# EAGLE design blackmagic_richardeoin (EAGLE 7.4.0)
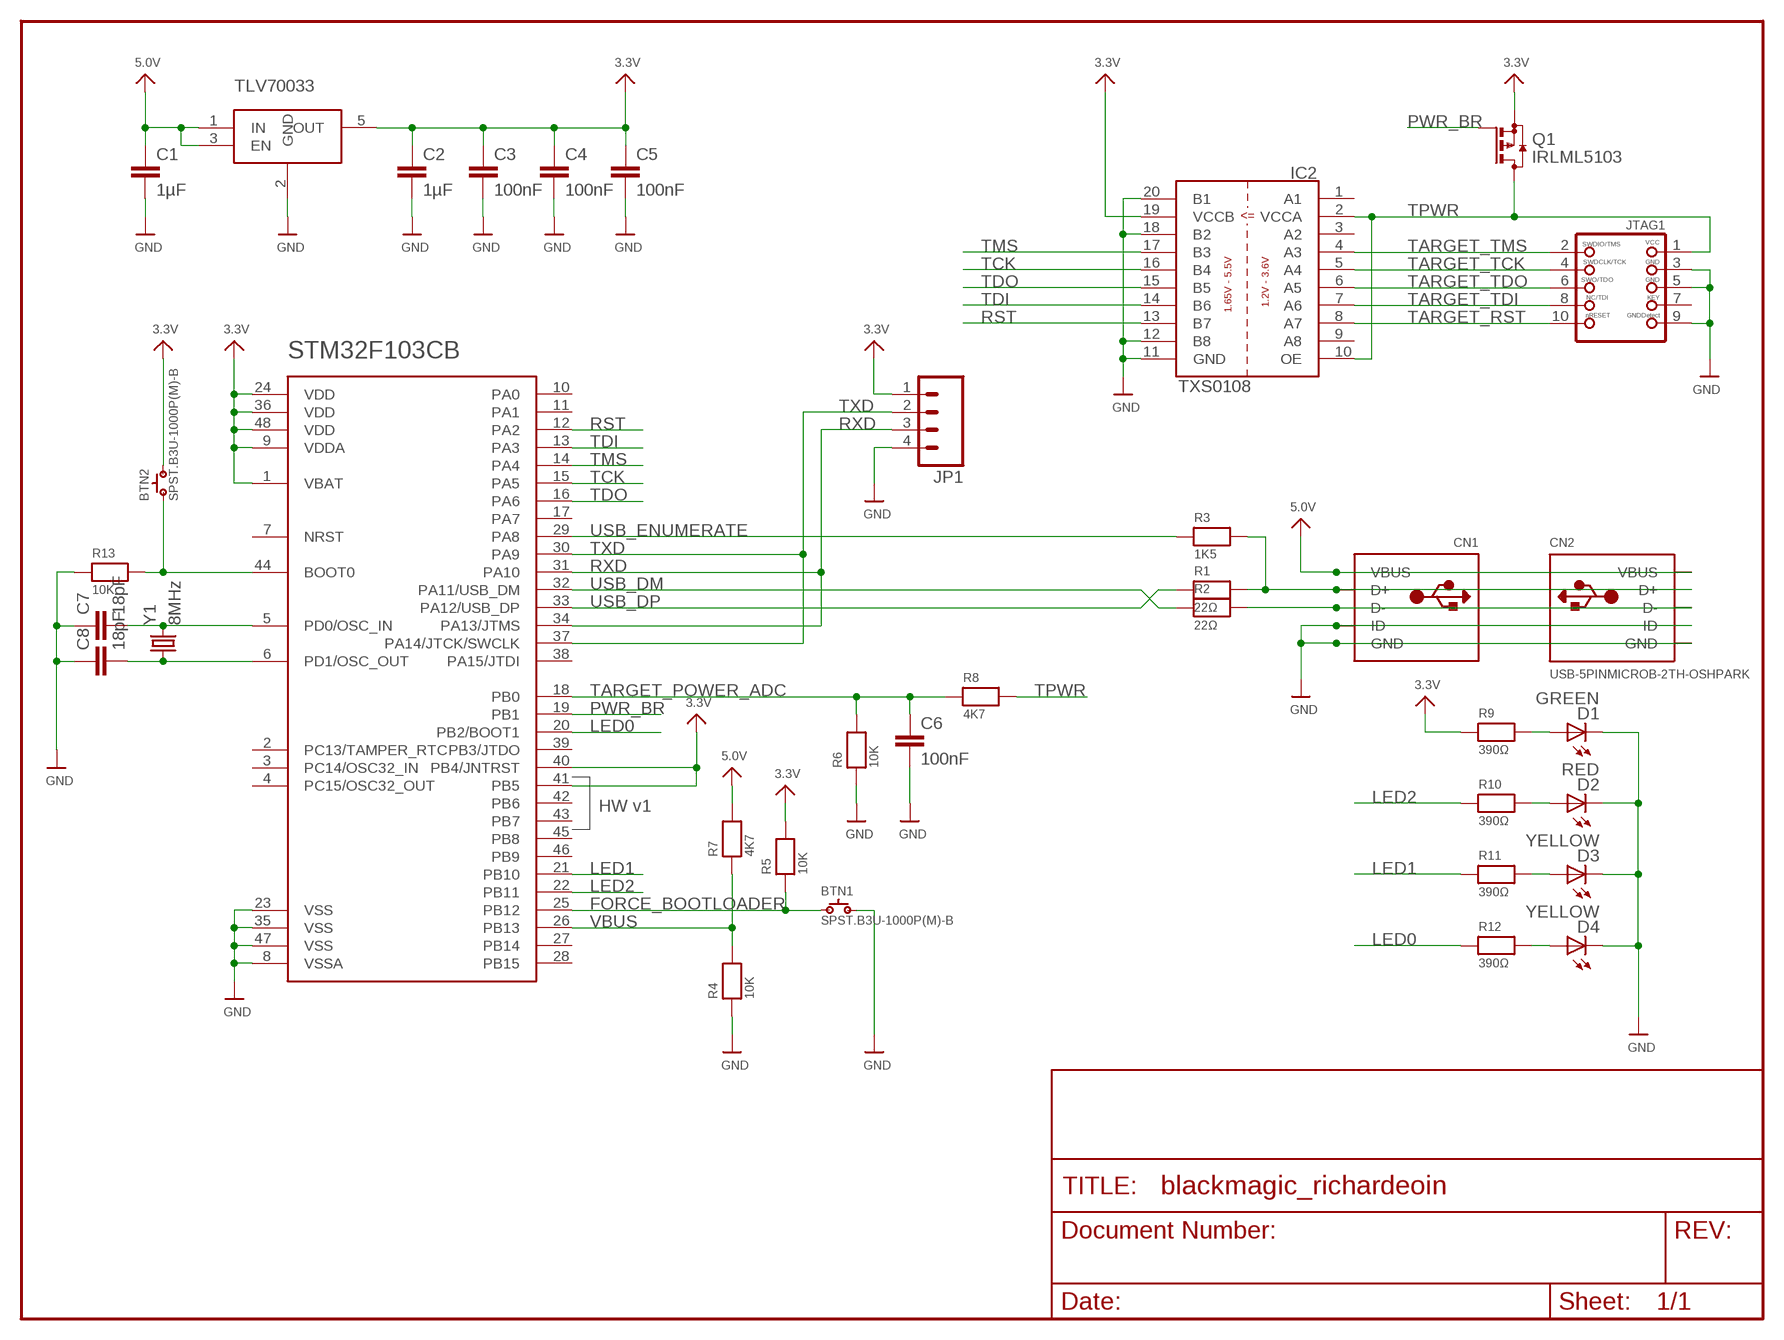
[diagram p0: schematic, sheet 1]

## Parts
BTN1  SPST.B3U-1000P(M)-B  [B3U-1000P(M)-B]
BTN2  SPST.B3U-1000P(M)-B  [B3U-1000P(M)-B]
C1  1µF  C-EUC0603K  [C0603K]
C2  1µF  C-EUC0603K  [C0603K]
C3  100nF  C-EUC0603K  [C0603K]
C4  100nF  C-EUC0603K  [C0603K]
C5  100nF  C-EUC0603K  [C0603K]
C6  100nF  C-EUC0603K  [C0603K]
C7  18pF  C-EUC0603K  [C0603K]
C8  18pF  C-EUC0603K  [C0603K]
CN1  USBMINIB  [USB-MINIB]
CN2  USB-5PINMICROB-2TH-OSHPARK  [USB-MICROB-2TH-OSHPARK]
D1  GREEN  LEDCHIPLED_0603  [CHIPLED_0603]
D2  RED  LEDCHIPLED_0603  [CHIPLED_0603]
D3  YELLOW  LEDCHIPLED_0603  [CHIPLED_0603]
D4  YELLOW  LEDCHIPLED_0603  [CHIPLED_0603]
IC1  STM32F_48PIN  [TQFP48]
IC2  TXS0108  TX0108PWR  [TSSOP20]
IC3  TLV70033DCK  TLV700DCK  [SC70-5L]
JP1  M04LOCK  [1X04_LOCK]
JTAG1  JTAG-CORTEXM3TH  [2X05_1.27MM_TH]
Q1  IRLML5103  BSS84  [SOT23]
R1  22Ω  RESISTOR0603MINI  [0603-MINI]
R2  22Ω  RESISTOR0603MINI  [0603-MINI]
R3  1K5  RESISTOR0603MINI  [0603-MINI]
R4  10K  RESISTOR0603MINI  [0603-MINI]
R5  10K  RESISTOR0603MINI  [0603-MINI]
R6  10K  RESISTOR0603MINI  [0603-MINI]
R7  4K7  RESISTOR0603MINI  [0603-MINI]
R8  4K7  RESISTOR0603MINI  [0603-MINI]
R9  390Ω  RESISTOR0603MINI  [0603-MINI]
R10  390Ω  RESISTOR0603MINI  [0603-MINI]
R11  390Ω  RESISTOR0603MINI  [0603-MINI]
R12  390Ω  RESISTOR0603MINI  [0603-MINI]
R13  10K  RESISTOR0603MINI  [0603-MINI]
Y1  8MHz  CRYSTAL5X3  [CRYSTAL-SMD-5X3]

## Nets
3.3V: BTN2.2 C2.1 C3.1 C4.1 C5.1 IC1.1(VBAT) IC1.9(VDDA) IC1.24(VDD) IC1.36(VDD) IC1.40(PB4/JNTRST) IC1.41(PB5) IC1.48(VDD) IC2.19(VCCB) IC3.5(OUT) JP1.1 Q1.2(S) R5.2 R9.1
5.0V: C1.1 CN1.VBUS CN2.VBUS IC3.1(IN) IC3.3(EN) R7.2
BOOT0: BTN2.1 IC1.44(BOOT0) R13.2
D+: CN1.D+ CN2.D+ R1.2 R3.2
D-: CN1.D- CN2.D- R2.2
FORCE_BOOTLOADER: BTN1.1 IC1.25(PB12) R5.1
GND: BTN1.2 C1.2 C2.2 C3.2 C4.2 C5.2 C6.2 C7.1 C8.1 CN1.GND CN1.ID CN2.GND CN2.ID D1.C D2.C D3.C D4.C IC1.8(VSSA) IC1.23(VSS) IC1.35(VSS) IC1.47(VSS) IC2.11(GND) IC2.12(B8) IC2.18(B2) IC2.20(B1) IC3.2(GND) JP1.4 JTAG1.3 JTAG1.5 JTAG1.9 R4.1 R6.1 R13.1
LED0: IC1.20(PB2/BOOT1) R12.1
LED1: IC1.21(PB10) R11.1
LED2: IC1.22(PB11) R10.1
LPC_XTAL2: C8.2 IC1.6(PD1/OSC_OUT) Y1.1
N$2: D2.A R10.2
N$4: D1.A R9.2
N$6: D3.A R11.2
N$8: D4.A R12.2
OSC_IN: C7.2 IC1.5(PD0/OSC_IN) Y1.3
PWR_BR: IC1.19(PB1) Q1.1(G)
RST: IC1.12(PA2) IC2.13(B7)
RXD: IC1.31(PA10) IC1.34(PA13/JTMS) JP1.3
TARGET_POWER_ADC: C6.1 IC1.18(PB0) R6.2 R8.1
TARGET_RST: IC2.8(A7) JTAG1.10
TARGET_TCK: IC2.5(A4) JTAG1.4
TARGET_TDI: IC2.7(A6) JTAG1.8
TARGET_TDO: IC2.6(A5) JTAG1.6
TARGET_TMS: IC2.4(A3) JTAG1.2
TCK: IC1.15(PA5) IC2.16(B4)
TDI: IC1.13(PA3) IC2.14(B6)
TDO: IC1.16(PA6) IC2.15(B5)
TMS: IC1.14(PA4) IC2.17(B3)
TPWR: IC2.2(VCCA) IC2.10(OE) JTAG1.1 Q1.3(D) R8.2
TXD: IC1.30(PA9) IC1.37(PA14/JTCK/SWCLK) JP1.2
USB_DM: IC1.32(PA11/USB_DM) R2.1
USB_DP: IC1.33(PA12/USB_DP) R1.1
USB_ENUMERATE: IC1.29(PA8) R3.1
VBUS: IC1.26(PB13) R4.2 R7.1
Unconnected: IC1.2(PC13/TAMPER_RTC) IC1.3(PC14/OSC32_IN) IC1.4(PC15/OSC32_OUT) IC1.7(NRST) IC1.10(PA0) IC1.11(PA1) IC1.17(PA7) IC1.27(PB14) IC1.28(PB15) IC1.38(PA15/JTDI) IC1.39(PB3/JTDO) IC1.42(PB6) IC1.43(PB7) IC1.45(PB8) IC1.46(PB9) IC2.1(A1) IC2.3(A2) IC2.9(A8) JTAG1.7

## Notes on the sheet
- TLV70033
- STM32F103CB
- HW v1

## Library data of the parts
BTN1 BTN2 = omron:SPST
C1-C8 = resistor:C-EU: CAPACITOR, European symbol
CN1 = blackmagic_richardeoin:USB: USB Connectors USBMINIB - Surface Mount Female Mini-B USB Connector 4UConnector: 06564
CN2 = flabbergast:USB-5PIN
D1-D4 = led:LED: LED OSRAM: - CHIPLED LG R971, LG N971, LY N971, LG Q971, LY Q971, LO R971, LY R971 LH N974, LH R974 LS Q976, LO Q976, LY Q976 LO Q996 - Hyper CHIPLED LW Q18S LB Q993, LB Q99A, LB R99A - SideLED LS A670, LO A670, LY A670, LG A670, LP A670 LB A673, LV A673, LT A673, LW A673 LH A674 LY A675 LS A676, LA A676, LO A676, LY A676, LW A676 LS A679, LY A679, LG A679 - Hyper Micro SIDELED® LS Y876, LA Y876, LO Y876, LY Y876 LT Y87S - SmartLED LW L88C, LW L88S LB L89C, LB L89S, LG L890 LS L89K, LO L89K, LY L89K LS L896, LA L896, LO L896, LY L896 - TOPLED LS T670, LO T670, LY T670, LG T670, LP T670 LSG T670, LSP T670, LSY T670, LOP T670, LYG T670 LG T671, LOG T671, LSG T671 LB T673, LV T673, LT T673, LW T673 LH T674 LS T676, LA T676, LO T676, LY T676, LB T676, LH T676, LSB T676, LW T676 LB T67C, LV T67C, LT T67C, LS T67K, LO T67K, LY T67K, LW E67C LS E67B, LA E67B, LO E67B, LY E67B, LB E67C, LV E67C, LT E67C LW T67C LS T679, LY T679, LG T679 LS T770, LO T770, LY T770, LG T770, LP T770 LB T773, LV T773, LT T773, LW T773 LH T774 LS E675, LA E675, LY E675, LS T675 LS T776, LA T776, LO T776, LY T776, LB T776 LHGB T686 LT T68C, LB T68C - Hyper Mini TOPLED® LB M676 - Mini TOPLED Santana® LG M470 LS M47K, LO M47K, LY M47K Source: http://www.osram.convergy.de LUXEON: - LUMILED® LXK2-PW12-R00, LXK2-PW12-S00, LXK2-PW14-U00, LXK2-PW14-V00 LXK2-PM12-R00, LXK2-PM12-S00, LXK2-PM14-U00 LXK2-PE12-Q00, LXK2-PE12-R00, LXK2-PE12-S00, LXK2-PE14-T00, LXK2-PE14-U00 LXK2-PB12-K00, LXK2-PB12-L00, LXK2-PB12-M00, LXK2-PB14-N00, LXK2-PB14-P00, LXK2-PB14-Q00 LXK2-PR12-L00, LXK2-PR12-M00, LXK2-PR14-Q00, LXK2-PR14-R00 LXK2-PD12-Q00, LXK2-PD12-R00, LXK2-PD12-S00 LXK2-PH12-R00, LXK2-PH12-S00 LXK2-PL12-P00, LXK2-PL12-Q00, LXK2-PL12-R00 Source: www.luxeon.com KINGBRIGHT: KA-3528ASYC Source: www.kingbright.com
IC1 = stm32f:STM32F_48PIN
IC2 = dan-translate:TX0108: TXB0108 or TXS0108
IC3 = tlv700:TLV700
JP1 = SparkFun:M04: Header 4 Standard 4-pin 0.1" header. Use with straight break away headers (SKU : PRT-00116), right angle break away headers (PRT-00553), swiss pins (PRT-00743), machine pins (PRT-00117), and female headers (PRT-00115). Molex polarized connector foot print use with SKU : PRT-08231 with associated crimp pins and housings. 1MM SMD Version SKU: PRT-10208
JTAG1 = blackmagic_richardeoin:JTAG-CORTEXM3: Serial Wire (SW-DP) Connector This standard 0.05" 10-pin connector is for use with the Cortex M0/M3's native SWD (serial wire debugger) interface (SW-DP). Some boards support a 20-pin combined JTAG+SWD connector (SWJ-DP), such as the LPC1700 family, but many smaller devices only work with SWD which typically use the smaller 10-pin SW-DP connecter (the LPC1300 family, for example, only supports SWD). 2x05 1.27mm/0.05" Connector: This is the standard SMT connector defined by ARM for all Cortex devices, and should be used in most situations and for forward-compatibility since any new devices coming to market will likely use this connector. MOLEX 10 Pin 0.1" Connector: This 0.1" 10 pin connector has the same pin layout as the standard 0.05" connector, but is easier to work with if you are using standard jumper wires or custom cables to connect your SWD hardware. MOLEX 20 Pin 0.1" Connector: This 0.1" 20 pin connector is the same model used for ARM7/ARM9 JTAG debuggers, but is connected to match the pins on the Segger J-Link for ARM (which supports both JTAG and SWD debugging). See the following document from ARM for more information on Cortex M3 Debug Connectors: http://infocenter.arm.com/help/topic/com.arm.doc.faqs/attached/13634/cortex_debug_connectors.pdf And the following page for an overview with images of the different connector types: http://www.keil.com/peripherals/coresight/connectors.asp
Q1 = transistor-small-signal:BSS84: P-CHANNEL MOS FET
R1-R13 = microbuilder:RESISTOR: Resistors 0402 - 0402 Surface Mount Package 22 Ohm 1% 1/16W [Digikey: 311-22.0LRTR-ND] 33 Ohm 5% 1/16W 1.0K 5% 1/16W 1.5K 5% 1/16W 2.0K 1% 1/16W 10.0K 1% 1/16W [Digikey: 311-10.0KLRTR-ND] 10.0K 5% 1/16W [Digikey: RMCF0402JT10K0TR-ND] 12.1K 1% 1/16W [Digikey: 311-22.0LRTR-ND] 100.0K 5% 1/16W 0603 - 0603 Surface Mount Package 0 Ohm 1/10 Watt 1% Resistor 15 Ohm 1/10 Watt 1% Resistor 33 Ohm 1/10 Watt 1% Resistor 49.9 Ohm 1/10 Watt 1% Resistor 100 Ohm 1/10 Watt 1% Resistor 150 Ohm 1/10 Watt 1% Resistor 240 Ohm 1/10 Watt 1% Resistor 390 Ohm 1/10 Watt 1% Resistor 560 Ohm 1/10 Watt 1% Resistor 680 Ohm 1/10 Watt 1% Resistor 750 Ohm 1/10 Watt 1% Resistor 1.0K Ohm 1/10 Watt 1% Resistor 1.5K Ohm 1/10 Watt 1% Resistor 2.0K Ohm 1/10 Watt 1% Resistor 2.2K Ohm 1/10 Watt 1% Resistor 3.3K Ohm 1/10 Watt 1% Resistor 4.7K Ohm 1/10 Watt 1% Resistor 10.0K Ohm 1/10 Watt 1% Resistor 12.0K Ohm 1/10 Watt 1% Resistor 12.1K Ohm 1/10 Watt 1% Resistor 20.0K Ohm 1/10 Watt 1% Resistor 33.0K Ohm 1/10 Watt 1% Resistor 100.0K Ohm 1/10 Watt 1% Resistor 0805 - 0805 Surface Mount Package 0 Ohm 1/8 Watt 1% Resistor 33 Ohm 1/8 Watt 1% Resistor 100 Ohm 1/8 Watt 1% Resistor 150 Ohm 1/8 Watt 1% Resistor 200 Ohm 1/8 Watt 1% Resistor 240 Ohm 1/8 Watt 1% Resistor 330 Ohm 1/8 Watt 1% Resistor 390 Ohm 1/8 Watt 1% Resistor 470 Ohm 1/8 Watt 1% Resistor 1.0K Ohm 1/8 Watt 1% Resistor 1.5K Ohm 1/8 Watt 1% Resistor 2.0K Ohm 1/8 Watt 1% Resistor 4.7K Ohm 1/8 Watt 1% Resistor 5.1K Ohm 1/8 Watt 1% Resistor 5.6K Ohm 1/8 Watt 1% Resistor 10.0K Ohm 1/8 Watt 1% Resistor 22.0K Ohm 1/8 Watt 1% Resistor 33.0K Ohm 1/8 Watt 1% Resistor 100K Ohm 1/8 Watt 1% Resistor 1206 - 1206 Surface Mount Package 2012 - 2010 Surface Mount Package 0.11 Ohm 1/2 Watt 1% Resistor - Digikey: RHM.11UCT-ND
Y1 = SparkFun:CRYSTAL: Crystals Various standard crystals. Proven footprints. Spark Fun Electronics SKU : COM-00534

## Board
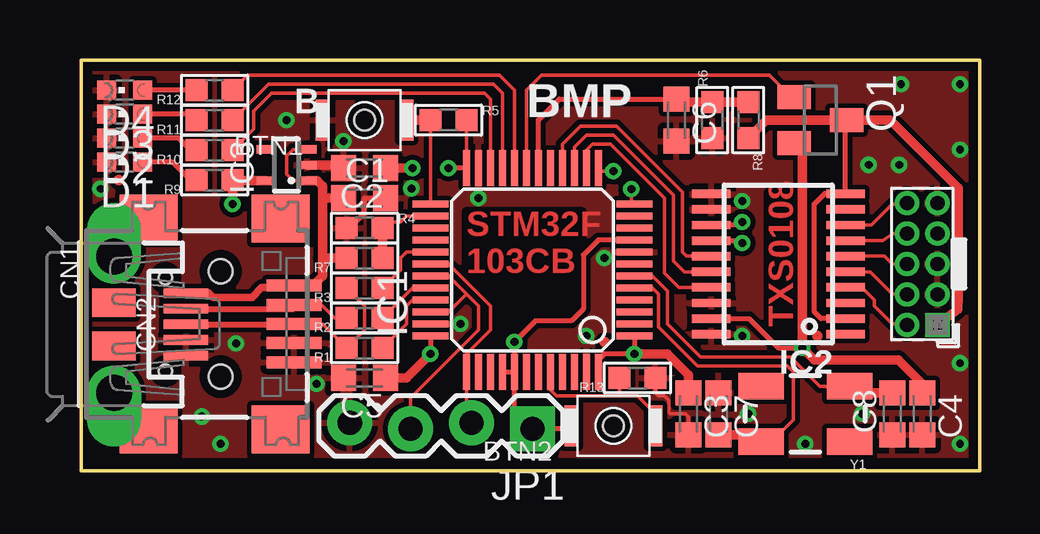
[diagram p1: board, top side]
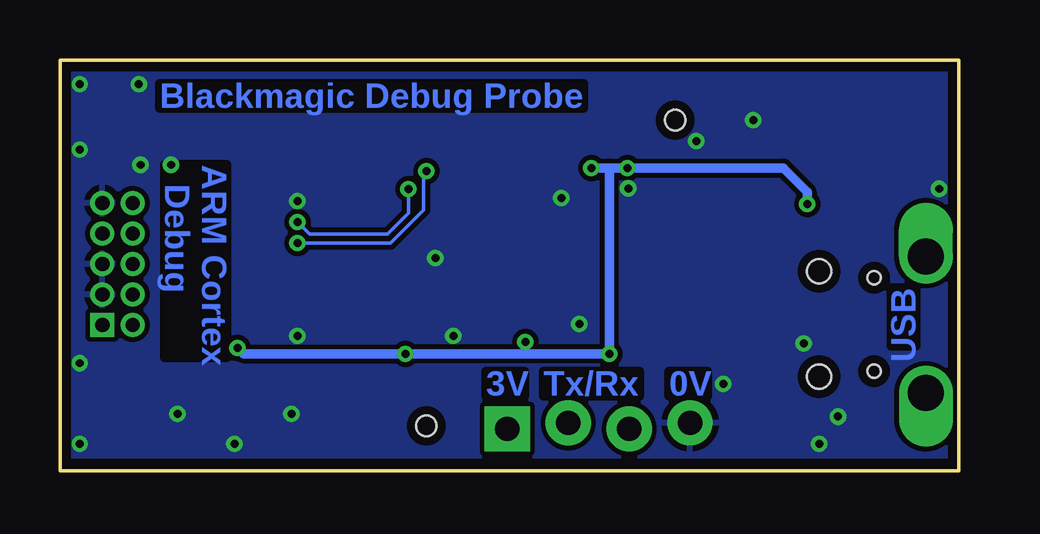
[diagram p2: board, bottom side, seen from below]

Size 37.47 x 17.15 mm. Coordinates in mm from the lower left corner, seen from the top.
Outline: 0,0 37.47,0 37.47,17.15 0,17.15 0,0
Copper layers (1*16): Top 0.0356mm / dielectric 1.5011mm / Bottom 0.0356mm
Design rules "LaenPCBOrder *": minimum track width 6mil, minimum drill 13mil, track to track 6mil, track to pad 6mil, pad to pad 6mil, via to via 6mil, smd to smd 0mil, copper to edge 15mil, drill to drill 6mil, minimum pad ring 7mil, minimum via ring 7mil, stop-mask expansion 3mil, vias tented up to drill 14mil, thermal gap 10mil

### Footprints (pad centres in the part's own frame; a part is rotated, then mirrored left to right if it is on the bottom)
B3U-1000P(M)-B = smd 0.6 x 1.7: 1 -1.75,0; 2 1.75,0 | hole 0.85: 0,0
C0603K = smd 1.05 x 1.08: 1 -0.875,0; 2 0.875,0
USB-MINIB = smd 0.5 x 2.308: D+ 0,4.064; D- -0.8,4.064; GND 1.6,4.064; ID 0.8,4.064; VBUS -1.6,4.064 | smd 2 x 2.4: GND1 -4.4,-2; GND2 -4.4,3.5; GND3 4.4,3.5; GND4 4.4,-2 | hole 1: -2.2,1; 2.2,1
USB-MICROB-2TH-OSHPARK = smd 0.4 x 1.84: D+ 0,3 | smd 0.4 x 1.85: D- -0.65,3; GND 1.3,3; ID 0.65,3; VBUS -1.3,3 | smd 1.2 x 1.8: MT1 -0.9,0; MT2 0.9,0 | drill 1.5 pad 2.15 offset: MT3 -2.825,0; MT4 2.85,0 | hole 0.55: -1.95,2.15; 1.95,2.15
CHIPLED_0603 = smd 0.8 x 0.8: A 0,-0.75; C 0,0.75
TQFP48 = smd 0.3 x 1.5: 1 -2.75,-4.25; 2 -2.25,-4.25; 3 -1.75,-4.25; 4 -1.25,-4.25; 5 -0.75,-4.25; 6 -0.25,-4.25; 7 0.25,-4.25; 8 0.75,-4.25; 9 1.25,-4.25; 10 1.75,-4.25; 11 2.25,-4.25; 12 2.75,-4.25; 25 2.75,4.25; 26 2.25,4.25; 27 1.75,4.25; 28 1.25,4.25; 29 0.75,4.25; 30 0.25,4.25; 31 -0.25,4.25; 32 -0.75,4.25; 33 -1.25,4.25; 34 -1.75,4.25; 35 -2.25,4.25; 36 -2.75,4.25 | smd 1.5 x 0.3: 13 4.25,-2.75; 14 4.25,-2.25; 15 4.25,-1.75; 16 4.25,-1.25; 17 4.25,-0.75; 18 4.25,-0.25; 19 4.25,0.25; 20 4.25,0.75; 21 4.25,1.25; 22 4.25,1.75; 23 4.25,2.25; 24 4.25,2.75; 37 -4.25,2.75; 38 -4.25,2.25; 39 -4.25,1.75; 40 -4.25,1.25; 41 -4.25,0.75; 42 -4.25,0.25; 43 -4.25,-0.25; 44 -4.25,-0.75; 45 -4.25,-1.25; 46 -4.25,-1.75; 47 -4.25,-2.25; 48 -4.25,-2.75
TSSOP20 = smd 0.35 x 1.6: 1 -2.925,-2.8; 2 -2.275,-2.8; 3 -1.625,-2.8; 4 -0.975,-2.8; 5 -0.325,-2.8; 6 0.325,-2.8; 7 0.975,-2.8; 8 1.625,-2.8; 9 2.275,-2.8; 10 2.925,-2.8; 11 2.925,2.8; 12 2.275,2.8; 13 1.625,2.8; 14 0.975,2.8; 15 0.325,2.8; 16 -0.325,2.8; 17 -0.975,2.8; 18 -1.625,2.8; 19 -2.275,2.8; 20 -2.925,2.8
SC70-5L = smd 0.35 x 0.8: 1 -0.65,-0.85; 2 0,-0.85; 3 0.65,-0.85; 4 0.65,0.85; 5 -0.65,0.85
1X04_LOCK = drill 1.016 pad 1.88 square: 1 0,0.127 | drill 1.016 pad 1.88: 2 2.54,-0.127; 3 5.08,0.127; 4 7.62,-0.127
2X05_1.27MM_TH = drill 0.6 pad 1.016 square: 1 -2.54,-0.635 | drill 0.6 pad 1.016: 2 -2.54,0.635; 3 -1.27,-0.635; 4 -1.27,0.635; 5 0,-0.635; 6 0,0.635; 7 1.27,-0.635; 8 1.27,0.635; 9 2.54,-0.635; 10 2.54,0.635
SOT23 = smd 1 x 1.4: 1 -0.95,-1.1; 2 0.95,-1.1; 3 0,1.1
0603-MINI = smd 0.9 x 0.9: 1 -0.75,0; 2 0.75,0
CRYSTAL-SMD-5X3 = smd 1.9 x 1.1: 1 -1.85,-1.15; 2 1.85,-1.15; 3 1.85,1.15; 4 -1.85,1.15

### Placement (x,y rotation side)
BTN1  11.82,14.63 180 top
BTN2  22.19,1.89 180 top
C1  11.82,11.38 0 top
C2  11.82,12.63 180 top
C3  25.32,2.38 270 top
C4  35.07,2.38 270 top
C5  11.82,3.88 180 top
C6  24.82,14.63 270 top
C7  26.57,2.38 270 top
C8  33.82,2.38 90 top
CN1  4.82,6.13 270 top
CN2  1.37,6.12 270 top
D1  1.82,12.88 90 top
D2  1.82,13.88 90 top
D3  1.82,14.88 90 top
D4  1.82,15.88 90 top
IC1  18.82,8.38 90 top
IC2  29.07,8.63 90 top
IC3  8.57,12.76 90 top
JP1  18.82,1.89 180 top
JTAG1  35.07,8.63 90 top
Q1  30.82,14.63 270 top
R1  11.82,5.13 180 top
R2  11.82,6.38 180 top
R3  11.82,7.63 180 top
R4  11.82,10.13 0 top
R5  15.32,14.63 0 top
R6  26.32,14.63 90 top
R7  11.82,8.88 180 top
R8  27.82,14.63 270 top
R9  5.57,12.13 180 top
R10  5.57,13.38 180 top
R11  5.57,14.63 180 top
R12  5.57,15.88 180 top
R13  23.19,3.88 180 top
Y1  30.19,2.38 180 top

### Tracks (layer width: path | path; a pad name or v marks a point on that pad's centre or on a via)
3.3V  (via drill 0.33 pad 0.69)
  Top 0.153: R5.2 IC1.24
  Top 0.2: IC1.41 18.07,2.51 JP1.1 20.44,1.76 BTN2.2 | IC1.40 IC1.41 | IC1.24 v15.32,12.63 | IC1.36 v14.57,4.88 | IC1.41 v18.07,5.38 18.94,6.26 20.44,6.26 20.94,6.76 20.94,9.01 21.57,9.63 IC1.9 | IC1.1 v23.07,4.88 21.82,4.88 21.57,4.63 IC1.48 | IC2.19 27.84,6.36 29.07,5.13 v30.07,5.13
  Top 0.4: IC3.5 6.34,12.11 | 6.34,12.11 R9.1 | C2.1 v13.82,12.63 | 6.34,12.11 6.32,12.08 v6.32,11.13 | C5.1 13.57,3.88 v14.57,4.88 | Q1.2 30.07,13.33 v30.07,5.13 30.57,4.63 34.07,4.63 35.07,3.63 C4.1 | v23.07,4.88 24.44,4.88 25.32,4.01 C3.1
  Bottom 0.4: v6.32,11.13 6.32,11.63 7.32,12.63 v13.82,12.63 14.57,12.63 | v15.32,12.63 14.57,12.63 | 14.57,12.63 v14.57,4.88 18.07,4.88 | 18.07,4.88 v23.07,4.88 29.82,4.88 v30.07,5.13 | 18.07,4.88 v18.07,5.38
5.0V
  Top 0.153: IC3.1 8.84,12.11 8.57,12.38 8.57,13.13 8.84,13.41 IC3.3
  Top 0.305: CN2.VBUS 5.32,7.42 5.5,7.24 7.12,7.24 7.53,7.64 8.79,7.64 CN1.VBUS
  Top 0.4: R7.2 10.07,8.88 | C1.1 10.07,11.38 | 10.07,11.38 10.07,8.88 | 10.07,8.88 10.07,8.13 9.67,7.73 CN1.VBUS | 10.07,11.38 10.07,11.88 9.84,12.11 IC3.1
BOOT0
  Top 0.153: IC1.44 19.57,3.38 19.82,3.13 22.44,3.13 | BTN2.1 23.94,2.38 23.19,3.13 22.44,3.13 | R13.2 22.44,3.13
D+
  Top 0.153: CN1.D+ 10.07,6.13 R1.2 11.82,5.88 11.82,6.88 R3.2
  Top 0.254: CN2.D+ 8.88,6.12 CN1.D+
D-
  Top 0.153: CN1.D- 10.02,6.93 10.57,6.38 R2.2
  Top 0.254: CN2.D- 8.88,6.77 CN1.D-
FORCE_BOOTLOADER
  Top 0.153: IC1.25 R5.1
  Top 0.4: R5.1 BTN1.1
GND  (via drill 0.33 pad 0.69)
  Top 0.153: R13.1 23.94,3.26 24.07,3.13 24.32,3.13 24.51,2.95 24.51,2.45 24.57,2.38 25.19,2.38 25.32,2.26 C3.2
  Top 0.2: R4.1 11.19,10.26 11.32,10.26 11.82,10.76 11.82,11.38 C1.2
  Top 0.4: IC3.2 10.82,12.76 C2.2
  other vias: 15.82,6.13 21.07,5.63 16.57,11.38 13.77,11.79 9.82,3.63 21.82,8.88 27.57,11.26 0.82,11.77 6.46,5.32 5.03,2.28 5.82,1.14 30.19,1.14 36.64,1.14 36.64,16.14 34.18,16.14 10.94,13.76 8.57,14.63 27.57,5.63 36.64,4.5 36.64,13.4 27.82,2.38 32.57,2.38 32.83,12.77 34.1,12.77
  pour Top (isolate 0.2): 0.32,16.64 37.14,16.64 37.14,0.64 0.32,0.64
  pour Bottom (isolate 0.2): 0.32,16.64 37.14,16.64 37.14,0.64 0.32,0.64
LED0
  Top 0.153: R12.1 6.94,16.51 17.44,16.51 18.07,15.88 IC1.20
LED1
  Top 0.153: R11.1 7.82,16.14 17.19,16.14 17.57,15.76 IC1.21
LED2
  Top 0.153: R10.1 7.19,14.26 7.19,15.01 7.94,15.76 16.82,15.76 17.07,15.51 IC1.22
LPC_XTAL2
  Top 0.153: IC1.6 23.82,8.13 24.44,7.51 24.44,6.13 25.82,4.76 29.57,4.76 30.79,3.54 Y1.1
  Top 0.4: Y1.1 32.32,3.26 C8.2
N$2
  Top 0.2: R10.2 4.57,13.38 4.07,13.88 D2.A
N$4
  Top 0.2: R9.2 4.57,12.13 3.82,12.88 D1.A
N$6
  Top 0.2: R11.2 4.57,14.88 D3.A
N$8
  Top 0.2: R12.2 D4.A
OSC_IN
  Top 0.153: IC1.5 23.82,7.63 24.07,7.38 24.07,6.01 25.69,4.38 29.44,4.38 29.69,4.13 29.69,2.13 28.79,1.23 Y1.3
  Top 0.4: Y1.3 28.07,1.51 C7.2
PWR_BR
  Top 0.153: IC1.19 18.57,15.88 19.19,16.51 28.69,16.51 29.32,15.88 29.42,15.88 Q1.1
RST  (via drill 0.33 pad 0.69)
  Top 0.153: IC1.12 22.94,11.26 v22.94,11.76
  Top 0.2: v27.57,10.38 27.44,10.26 IC2.13
  Bottom 0.153: v27.57,10.38 27.07,9.88 23.82,9.88 22.94,10.76 v22.94,11.76
RXD
  Top 0.153: IC1.31 15.32,8.13 16.07,7.38 | JP1.3 13.74,3.05 16.57,5.88 16.57,6.88 16.07,7.38 | IC1.34 15.32,6.63 16.07,7.38
TARGET_POWER_ADC
  Top 0.2: IC1.18 19.07,14.63 19.94,15.51 C6.1
  Top 0.4: R8.1 R6.2 24.94,15.38 C6.1
TARGET_RST
  Top 0.153: IC2.8 32.94,10.26 33.82,11.13 34.43,11.13 JTAG1.10
TARGET_TCK
  Top 0.153: JTAG1.4 34.39,7.38 33.82,7.38 32.89,8.31 IC2.5
TARGET_TDI
  Top 0.153: IC2.7 33.42,9.61 33.82,9.88 33.84,9.9 JTAG1.8
TARGET_TDO
  Top 0.153: JTAG1.6 33.82,8.63 33.49,8.96 IC2.6
TARGET_TMS
  Top 0.153: IC2.4 32.54,7.66 33.07,7.13 33.07,6.88 33.82,6.13 34.18,6.13 JTAG1.2
TCK
  Top 0.153: IC2.16 25.14,8.31 24.69,8.76 24.69,11.51 22.19,14.01 21.07,14.01 20.57,13.51 IC1.15
TDI  (via drill 0.33 pad 0.69)
  Top 0.153: IC1.13 21.69,12.51 v22.19,12.51
  Top 0.2: IC2.14 27.47,9.61 v27.57,9.51
  Bottom 0.153: v22.19,12.51 22.32,12.38 22.32,10.88 23.69,9.51 v27.57,9.51
TDO
  Top 0.153: IC2.15 25.24,8.96 25.07,9.13 25.07,11.63 22.32,14.38 20.82,14.38 20.07,13.63 IC1.16
TMS
  Top 0.153: IC2.17 24.92,7.66 24.32,8.26 24.32,11.38 22.07,13.63 21.32,13.63 21.07,13.38 IC1.14
TPWR
  Top 0.2: Q1.3 31.87,14.58 IC2.10 31.73,11.57 31.01,11.57 30.57,11.13 30.57,6.63 30.84,6.36 IC2.2
  Top 0.4: R8.2 28.57,14.63 Q1.3 33.73,14.63 36.57,11.8 36.57,7.27 36.55,6.75 JTAG1.1
TXD
  Top 0.153: IC1.30 15.32,8.63 17.07,6.88 17.07,5.88 16.07,4.88 IC1.37 16.07,2.22 JP1.2
USB_DM
  Top 0.153: IC1.32 13.82,7.63 R2.1
USB_DP
  Top 0.153: IC1.33 13.82,7.13 13.57,6.88 13.57,6.13 R1.1
USB_ENUMERATE
  Top 0.153: IC1.29 13.57,9.13 13.32,8.88 13.32,8.38 R3.1
VBUS
  Top 0.153: IC1.26 13.57,10.63 13.32,10.38 12.57,10.38 R4.2
  Top 0.4: R7.1 R4.2
(copper drawn outside any net)
  shapes: Top circle x3

### Text on the board
Top: STM32F / 103CB | TXS0108
Bottom: Blackmagic Debug Probe | ARM Cortex / Debug | USB | 0V | Tx/Rx | 3V
tPlace: B | BMP
tStop: STM32F / 103CB | TXS0108
bStop: Blackmagic Debug Probe | ARM Cortex / Debug | USB | 0V | Tx/Rx | 3V